# Altium schematic sheet MainSchematic.SchDoc
size A3
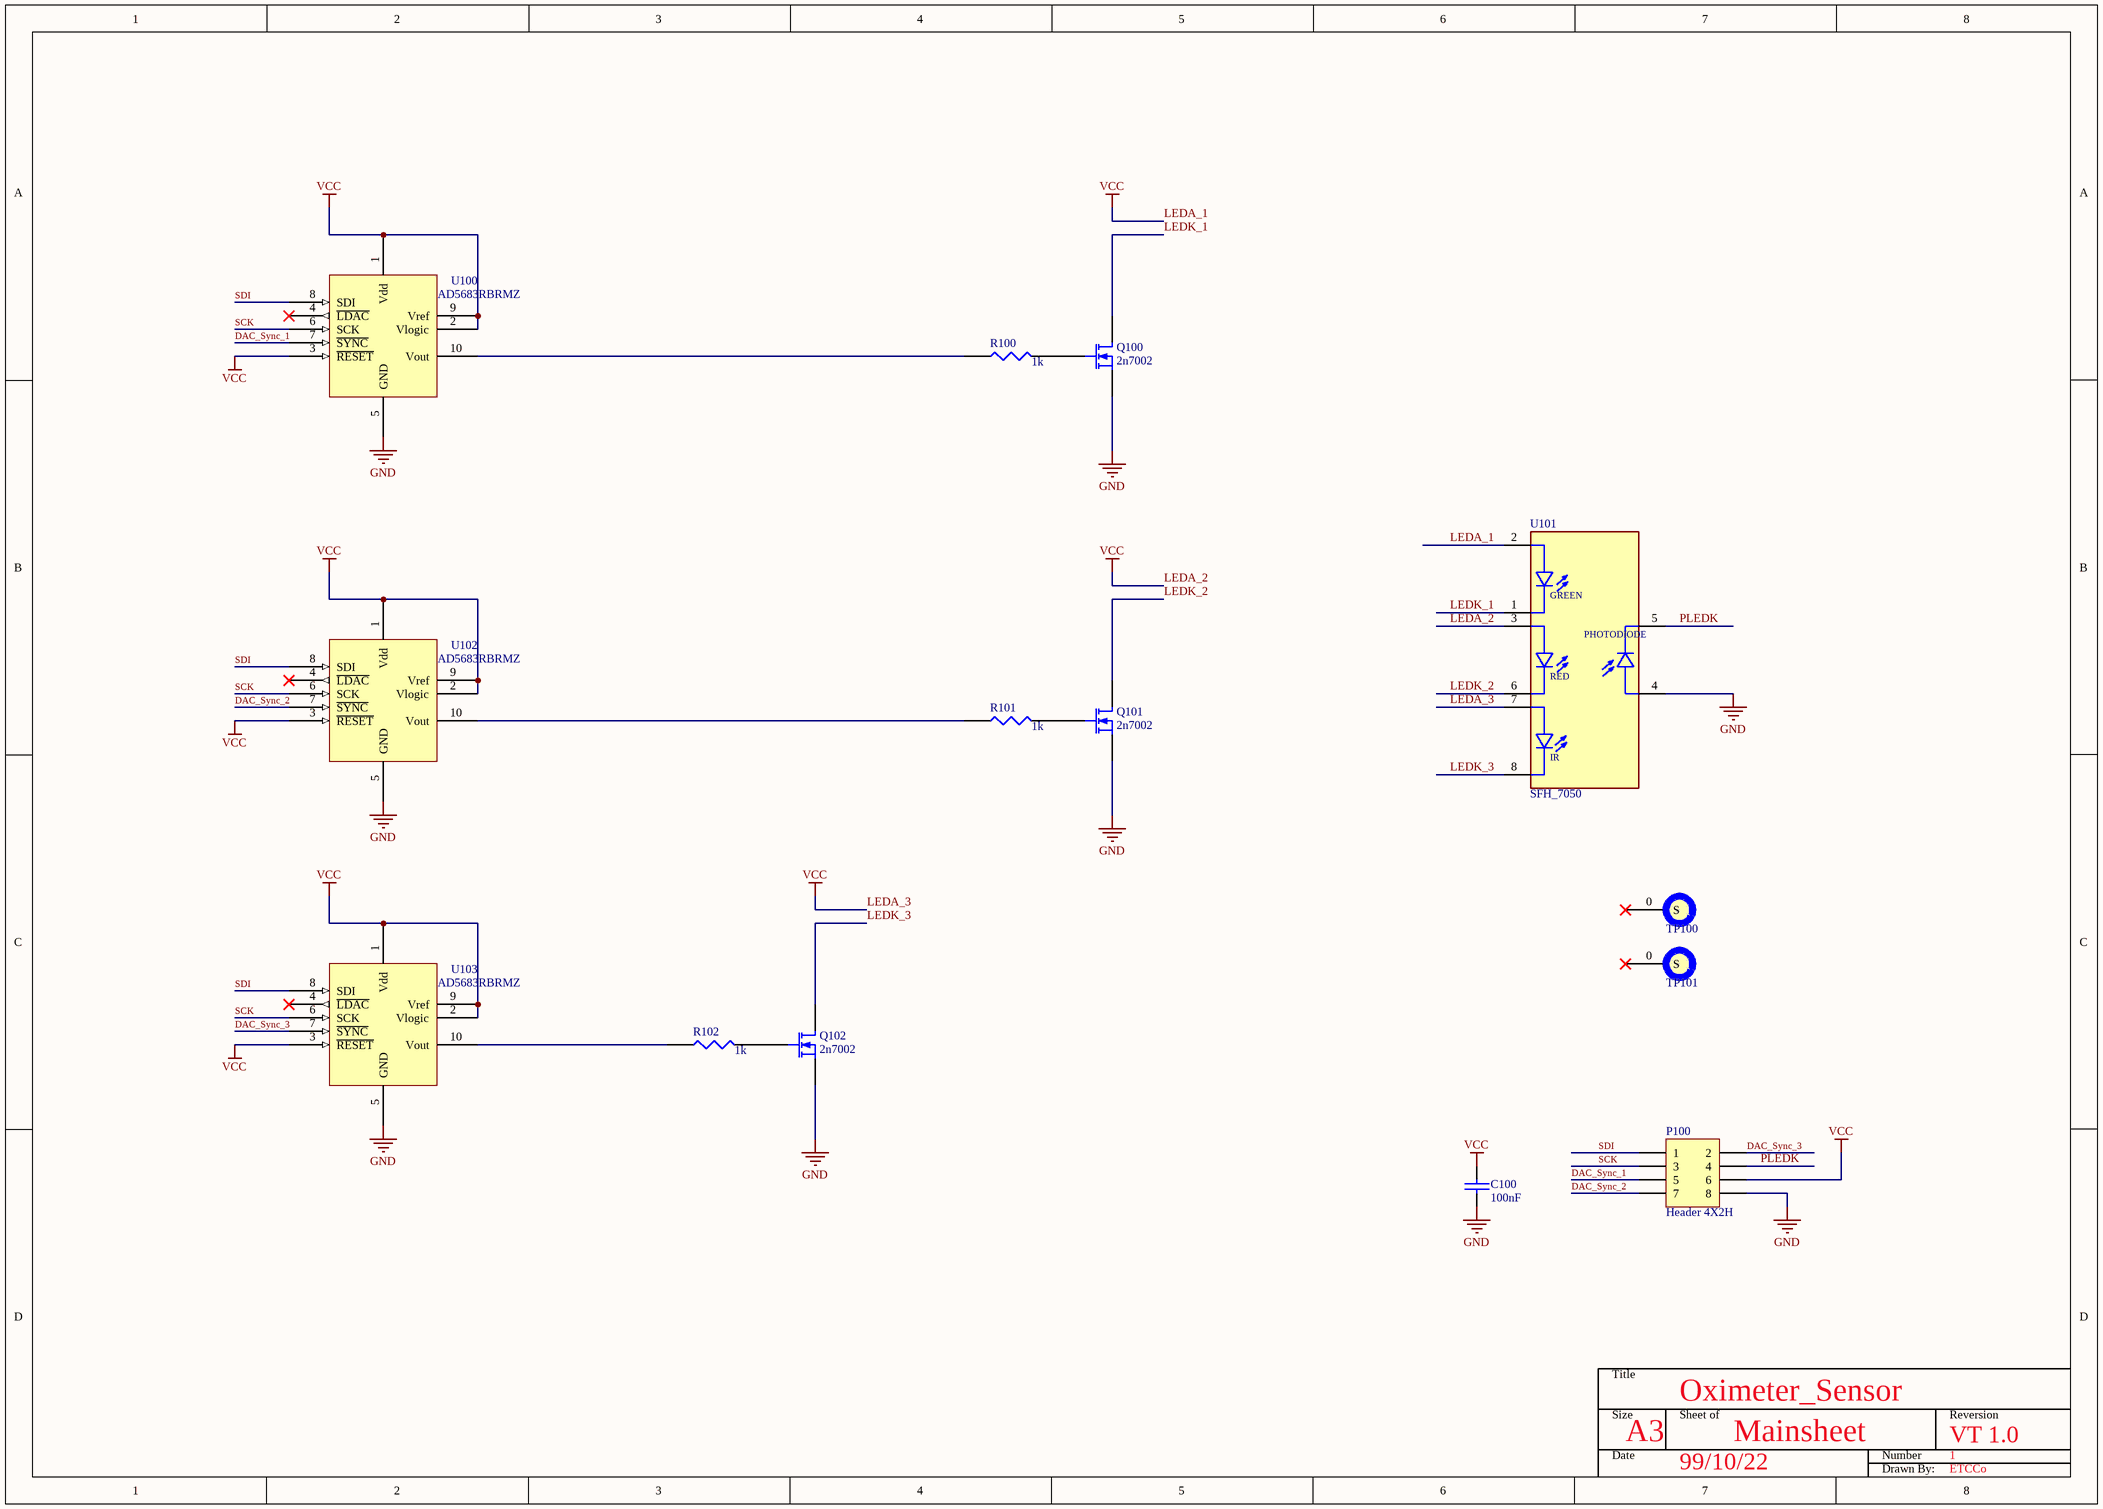
[diagram p0: MainSchematic.SchDoc]

## Parts
C100  100nF  [0603-2]
P100  Header 4X2H  [HDR2X4_edited]
Q100  2n7002  [a_SOT23]
Q101  2n7002  [a_SOT23]
Q102  2n7002  [a_SOT23]
R100  1k  [0603-2]
R101  1k  [0603-2]
R102  1k  [0603-2]
TP100  HOLE  [A_Ert]  (value not drawn)
TP101  HOLE  [A_Ert]  (value not drawn)
U100  AD5683RBRMZ  [MSOP-10]
U101  SFH_7050  [XDCR_SFH_7050]
U102  AD5683RBRMZ  [MSOP-10]
U103  AD5683RBRMZ  [MSOP-10]

## Nets
GND: C100.2 P100.8 Q100.2(S) Q101.2(S) Q102.2(S) U100.5(GND) U101.4(PA) U102.5(GND) U103.5(GND)
LEDA_1: C100.1 P100.6 U100.1(Vdd) U100.2(Vlogic) U100.3(~{RESET}) U100.9(Vref) U101.2(GA) U101.3(RA) U101.7(IA) U102.1(Vdd) U102.2(Vlogic) U102.3(~{RESET}) U102.9(Vref) U103.1(Vdd) U103.2(Vlogic) U103.3(~{RESET}) U103.9(Vref)  [also labelled LEDA_2, LEDA_3, VCC]
DAC_Sync_1: P100.5 U100.7(~{SYNC})
DAC_Sync_2: P100.7 U102.7(~{SYNC})
DAC_Sync_3: P100.2 U103.7(~{SYNC})
LEDK_1: Q100.3(D) U101.1(GC)
LEDK_2: Q101.3(D) U101.6(RC)
LEDK_3: Q102.3(D) U101.8(IC)
PLEDK: P100.4 U101.5(PC)
SCK: P100.3 U100.6(SCK) U102.6(SCK) U103.6(SCK)
SDI: P100.1 U100.8(SDI) U102.8(SDI) U103.8(SDI)
NetQ100_1: Q100.1(G) R100.2
NetQ101_1: Q101.1(G) R101.2
NetQ102_1: Q102.1(G) R102.2
NetR100_1: R100.1 U100.10(Vout)
NetR101_1: R101.1 U102.10(Vout)
NetR102_1: R102.1 U103.10(Vout)

Not connected (* = marked no-connect by the designer): TP100 0(S)*; TP101 0(S)*; U100 4(~{LDAC})*; U102 4(~{LDAC})*; U103 4(~{LDAC})*

## Notes on the sheet
- Title
- Size
- Date
- A3
- Oximeter_Sensor
- Sheet of
- Mainsheet
- Number
- Reversion
- VT 1.0
- 1
- 99/10/22
- Drawn By:
- ETCCo
- (in symbol SFH_7050) GREEN; PHOTODIODE; RED; IR

## Library data of the parts
C100 = CAP: Capacitor
P100 = Header 4X2H: Header, 4-Pin, Dual row, Right Angle; LatestRevisionDate: 17-Jul-2002; LatestRevisionNote: Re-released for DXP Platform.; Publisher: Altium Limited
Q100-Q102 = MOSFET-N: N-Channel MOSFET; Published: 8-Jun-2000; LatestRevisionDate: 17-Jul-2002; LatestRevisionNote: Re-released for DXP Platform.; PackageVersion: 1995/1996; PackageReference: E3; Publisher: Altium Limited; PackageDescription: TO, Flat Index; 3 In-Line, Axial Leads; Body Dia. 4.6mm; Lead Dia. 0.5 mm (max)
R100-R102 = RES1
TP100 TP101 = TP
U100 U102 U103 = AD5683RBRMZ: Tiny 16-/14-/12-Bit SPI nanoDAC+, with  ±2 (16-Bit) LSB INL and 2 ppm/°C Reference
U101 = SFH_7050: Salida de voltaje del sensor de ox?­metro / frecuencia card?­aca; MF: OSRAM Opto; Digi-Key_Part_Number: 475-3346-1-ND; Digi-Key_Purchase_URL: https://www.digikey.com/product-detail/en/osram-opto-semiconductors-inc/SFH-7050/475-3346-1-ND/7645273?utm_source=snapeda&utm_medium=aggregator&utm_campaign=symbol; Package: None; MP: SFH 7050; Value: *; SnapEDA_Link: https://www.snapeda.com/parts/SFH%207050/OSRAM%20Opto%20Semiconductors%20Inc./view-part/227176/?ref=snap